# Altium schematic sheet charge_pump.SchDoc
size A; SheetNumber: 6; SheetTotal: 9
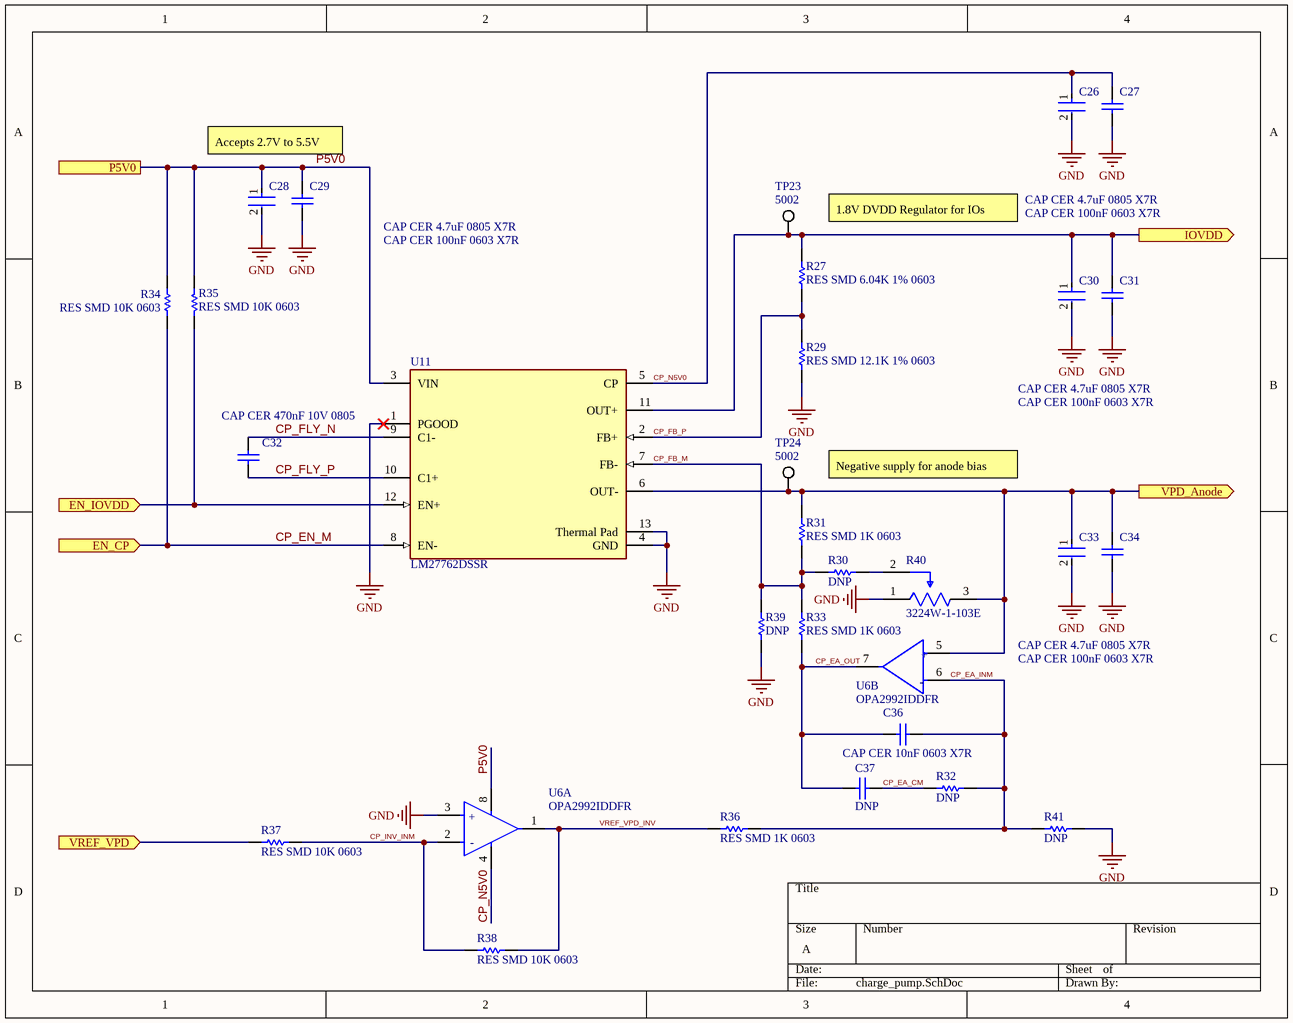
[diagram p0: charge_pump.SchDoc]

## Parts
C26  CAP CER 100nF 0603 X7R  [FP-CC0603-DA-MFG]
C27  CAP CER 4.7uF 0805 X7R  [CAPC2013X140X50NL20T25]
C28  CAP CER 100nF 0603 X7R  [FP-CC0603-DA-MFG]
C29  CAP CER 4.7uF 0805 X7R  [CAPC2013X140X50NL20T25]
C30  CAP CER 100nF 0603 X7R  [FP-CC0603-DA-MFG]
C31  CAP CER 4.7uF 0805 X7R  [CAPC2013X140X50NL20T25]
C32  CAP CER 470nF 10V 0805  [CAPC0805(2012)145_M]
C33  CAP CER 100nF 0603 X7R  [FP-CC0603-DA-MFG]
C34  CAP CER 4.7uF 0805 X7R  [CAPC2013X140X50NL20T25]
C36  CAP CER 10nF 0603 X7R  [CAPC1608X90X40ML10T20]
C37  DNP  [CAPC1608X90X40ML10T20]
R27  RES SMD 6.04K 1% 0603  [RESC1608X55X30LL10T20_A]
R29  RES SMD 12.1K 1% 0603  [RESC1608X55X30LL10T20_A]
R30  DNP  [RESC1608X55X30LL10T20_A]
R31  RES SMD 1K 0603  [RESC1608X55X30LL10T20_A]
R32  DNP  [RESC1609X50X30LL10T20]
R33  RES SMD 1K 0603  [RESC1608X55X30LL10T20_A]
R34  RES SMD 10K 0603  [RESC1609X55X30LL15T15]
R35  RES SMD 10K 0603  [RESC1609X55X30LL15T15]
R36  RES SMD 1K 0603  [RESC1608X55X30LL10T20_A]
R37  RES SMD 10K 0603  [RESC1608X55X30LL10T20_A]
R38  RES SMD 10K 0603  [RESC1608X55X30LL10T20_A]
R39  DNP  [RESC1608X55X30LL10T20_A]
R40  3224W-1-103E  [FP-3224W-MFG]
R41  DNP  [RESC1609X50X30LL10T20]
TP23  5002  [KSTN-5002]
TP24  5002  [KSTN-5002]
U6  OPA2992IDDFR  [FP-DDF0008A-MFG]  (parts A,B of 2)
U11  LM27762DSSR  [FP-DSS0012B-MFG]

## Ports
EN_CP (in), EN_IOVDD (in), IOVDD (out), P5V0, VPD_Anode (out), VREF_VPD (in)

## Nets
GND: C26.2 C27.2 C28.2 C29.2 C30.2 C31.2 C33.2 C34.2 R29.1 R39.1 R40.1(CCW) R41.1 U6.3(IN1+) U11.1(PGOOD) U11.4(GND) U11.13(Thermal_Pad)
CP_EA_CM: C37.2 R32.2
CP_EA_INM: C36.2 R32.1 R36.1 R41.2 U6.6(IN2-)
CP_EA_OUT: C36.1 C37.1 R33.1 U6.7(OUT2)
CP_EN_M: R34.1 U11.8(EN-) ; port EN_CP
CP_FB_M: R30.2 R31.1 R33.2 R39.2 U11.7(FB-)
CP_FB_P: R27.1 R29.2 U11.2(FB+)
CP_FLY_N: C32.2 U11.9(C1-)
CP_FLY_P: C32.1 U11.10(C1+)
CP_INV_INM: R37.1 R38.2 U6.2(IN1-)
CP_N5V0: C26.1 C27.1 U6.4(V-) U11.5(CP)
EN_IOVDD: R35.1 U11.12(EN+) ; port EN_IOVDD
IOVDD: C30.1 C31.1 R27.2 TP23.1 U11.11(OUT+) ; port IOVDD
P5V0: C28.1 C29.1 R34.2 R35.2 U6.8(V+) U11.3(VIN) ; port P5V0
VPD_Anode: C33.1 C34.1 R31.2 R40.3(CW) TP24.1 U6.5(IN2+) U11.6(OUT-) ; port VPD_Anode
VREF_VPD: R37.2 ; port VREF_VPD
VREF_VPD_INV: R36.2 R38.1 U6.1(OUT1)
NetR30_1: R30.1 R40.2(WIPER)

## Notes on the sheet
- Accepts 2.7V to 5.5V
- 1.8V DVDD Regulator for IOs
- Negative supply for anode bias
- (in symbol CMP-04895-000462-1, part A) +; -
- (in symbol CMP-04895-000462-1, part B) +; -

## Library data of the parts
C26 C28 C30 C33 = CMP-03422-000030-1: CAP CER 0.1UF 16V X7R 0603; Manufacturer Part Number: CC0603KRX7R7BB104; Manufacturer: YAGEO; Tolerance: 0.1; Temperature Coefficient: 15%; Material: Ceramic; Voltage Rating: 16 V; Package: CC0603-DA; ComponentLink2Description: Datasheet; Octopart: https://octopart.com/cc0603krx7r7bb104-yageo-192941; Temperature Range High: +125°C; Digikey Description: CAP CER 0.1UF 16V X7R 0603; Value: 100 nF; Voltage: 16 V; Device Class L2: Capacitors; Height: 0.9mm; Temperature: -55°C to +125°C; Device Class L1: Passive Components; Device Class L3: Ceramic Capacitors; ComponentLink2URL: http://www.yageo.com/documents/recent/UPY-GPHC_X7R_6.3V-to-50V_18.pdf; Footprint Url: http://www.yageo.com/exep/pages/download/literatures/UPY-C_GEN_24.pdf; RoHS: TRUE; Temperature Range Low: -55°C; Temperature Characteristic: X7R; Lead Free: Yes; Capacitance: 100 nF; Category: Cap; Mouser Description: Multilayer Ceramic Capacitor, CC Series, 0.1 - F, - 10%, X7R, 16 V, 0603 [1608 Metric]; Automotive: No
C27 C29 C31 C34 = CMP-2007-04677-1: Part Number: 0805ZC475KAT2A; Manufacturer: AVX Interconnect / Elco
C32 = CMP-1036-04629-1: CAP 470nF 10V ±5% 0805 (2012 Metric) Thickness 1.45mm SMD; Case-EIA: 0805; Case-Metric: 2012; Tolerance: Â±5%; Max Thickness: 1.45 mm; Rated Voltage: 10 V; Technology: SMT; Value: 470nF
C36 = CMP-2100-03600-1: Chip Capacitor, 10 nF, +/- 10%, 50 V, -55 to 125 degC, 0603 (1608 Metric), RoHS, Tape and Reel; Manufacturer: Yageo; Insulation Resistance: 100GR; Voltage Rating (DC): 50V; Material: Ceramic; Lead Free: LeadFree; Case/Package: 0603; Datasheet Version: Rev. 15, 10/2016; Composition: Ceramic; Radiation Hardening: No; Thickness: 0.035inch; RoHSCompliant: True; Dielectric: X7R; Termination: SMD/SMT; Capacitance: 10nF; Manufacturer URL: http://www.yageo.com/; Tolerance: 10%; REACH SVHC: NoSVHC; Voltage: 50V; Max Operating Temperature: 125degC; Case Code (Metric): 1608; Package Quantity: 1; Case Code (Imperial): 0603; Packaging: TapeandReel; Package Reference: 0603; Width: 0.031inch; Datasheet URL: http://www.yageo.com/documents/recent/UPY-GPHC_X7R_6.3V-to-50V_15.pdf; Length: 1.6mm; Min Operating Temperature: -55degC; Number of Pins: 2; Depth: 0.8mm; Mount: SurfaceMount; Height: 0.8mm; Voltage Rating: 50V; Package Description: 2-Pin Surface Mount Device, Body 1.6 x 0.8 mm
C37 = CMP-2100-03600-1: Chip Capacitor, 10 nF, +/- 10%, 50 V, -55 to 125 degC, 0603 (1608 Metric), RoHS, Tape and Reel; Manufacturer: Yageo; Insulation Resistance: 100GR; Dielectric: X7R; Voltage Rating (DC): 50V; Capacitance: 10nF; Material: Ceramic; Lead Free: LeadFree; Case/Package: 0603; Datasheet Version: Rev. 15, 10/2016; Composition: Ceramic; Radiation Hardening: No; Thickness: 0.035inch; RoHSCompliant: True; Termination: SMD/SMT; Manufacturer URL: http://www.yageo.com/; Tolerance: 10%; REACH SVHC: NoSVHC; Voltage: 50V; Max Operating Temperature: 125degC; Case Code (Metric): 1608; Package Quantity: 1; Case Code (Imperial): 0603; Packaging: TapeandReel; Package Reference: 0603; Width: 0.031inch; Datasheet URL: http://www.yageo.com/documents/recent/UPY-GPHC_X7R_6.3V-to-50V_15.pdf; Length: 1.6mm; Min Operating Temperature: -55degC; Number of Pins: 2; Depth: 0.8mm; Mount: SurfaceMount; Height: 0.8mm; Voltage Rating: 50V; Package Description: 2-Pin Surface Mount Device, Body 1.6 x 0.8 mm
R27 R29-R31 R33 R36-R39 = CMP-2000-06686-1: Chip Resistor, 0 Ohm, +/- 5%, 100 mW, -55 to 155 degC, 0603 (1608 Metric), RoHS, Tape and Reel; Manufacturer: Rohm; Tolerance: Jumper; Power (Watts): 0.1W,1/10W; Resistance (Ohms): 0.0; Online Catalog: MCR03Series; EDA / CAD Models: DownloadfromAcceleratedDesigns; Other Names: RHM0.0CGTR; Series: MCR; Package Description: 2-Pin Surface Mount Device, Body 1.60 x 0.80 mm; Composition: ThickFilm; Height: 0.022"(0.55mm); Mounting Technology: SurfaceMount; Family: ChipResistor-SurfaceMount; Temperature Coefficient: -; Category: Resistors; Supplier Device Package: 0603(1608Metric); Package Reference: 0603; Size / Dimension: 0.063"Lx0.031"W(1.60mmx0.80mm); Standard Package: 5,000; Datasheet URL: http://www.rohm.com/web/global/datasheet/MCR03ERTJ; Features: -; Datasheet Version: Rev. F, 02/2015; Operating Temperature: -55°C~155°C; Package / Case: 0603(1608Metric); Manufacturer URL: http://www.rohm.com/web/global/; Packaging: Tape&Reel(TR); Number of Terminations: 2
R32 R41 = CMP-2000-03820-1: Part Number: CRCW0603100KFKEA; Manufacturer: Vishay Dale
R34 R35 = CMP-2000-07452-1: Chip Resistor, 10 KOhm, +/- 1%, 0.1 W, -55 to 155 degC, 0603 (1608 Metric), RoHS, Tape and Reel; Manufacturer: Panasonic; Voltage Rating: 75V; Case\/Package: 0603; Power Rating: 100mW; Resistance: 10KOhm; Temperature Coefficient: 100ppm\/degreesC; Number of Pins: 2; Package Reference: 603; Depth: 0.8mm; Mount: SurfaceMount; Package Description: 2-Pin Surface Mount Device, Body 1.6 x 0.85 mm; Datasheet Version: 02/2017; Length: 1.6mm; Lead Free: LeadFree; Height: 0.45mm; Number of Terminations: 2; Max Power Dissipation: 100mW; Min Operating Temperature: -55degC; Datasheet URL: https://industrial.panasonic.com/cdbs/www-data/pdf/RDA0000/AOA0000C304.pdf; Termination: SMD/SMT; Case Code (Metric): 1608; Case Code (Imperial): 0603; Tolerance: 1%; Max Operating Temperature: 155degC; RoHSCompliant: true; Voltage Rating (DC): 75V; Radiation Hardening: No; Packaging: TapeandReel; Composition: ThickFilm; Mounting Technology: SurfaceMount; Manufacturer URL: http://www.panasonic.com/; Width: 0.031inch; REACH SVHC: NoSVHC; Contact Plating: Tin; Military Standard: Not; Package Quantity: 1
R40 = CMP-07234-000002-1: TRIMMER 10K OHM 0.25W J LEAD TOP; Manufacturer: Bourns; Tolerance: 10%; Resistance: 10kΩ; Temperature Coefficient: 100ppm/°C; Value: 10kΩ; Standoff Height: 0.2mm; Voltage Rating: 300V; Power Rating: 250mW; Device Class L3: Variable Resistors and Potentiometers; Composition: Cermet; Temperature Range Low: -65°C; Package: 3224W; ComponentLink2Description: Datasheet; Digikey Description: TRIMMER 10K OHM 0.25W J LEAD TOP; Category: Res; Mouser Description: Trimmer Resistors - SMD 4mm 10Kohms 10% Square Cermet Sealed; Temperature: -65°C to +150°C; Device Class L2: Resistors; Device Class L1: Passive Components; RoHS: TRUE; Temperature Range High: +150°C; Manufacturer Part Number: 3224W-1-103E; ComponentLink2URL: https://upverter.com/datasheet/a166fca85da25564670351d2dc712345c058bc40.pdf; Series: 3224; Height: 5.55mm; Lead Free: Yes; Octopart: https://octopart.com/3224w-1-103e-bourns-14818; Automotive: No
TP23 TP24 = CMP-2000-05182-1: Test Point, White, 1-Pin THD, RoHS, Bulk; Manufacturer: KeystoneElectronics; Outside Diameter: 2.54mm; Plating: Silver; Mounting Hole Size: 1mm; Product: TestPoints; Packaging: Bulk; Manufacturer URL: http://www.keyelco.com/; Length: 7.62mm; Datasheet Version: Rev. G, 12/2008; Type: Miniature; Product Category: CircuitBoardHardware-PCB; Material: Nylon; RoHS: True; Contact Material: PhosphorBronze; Datasheet URL: https://ciiva.com/datasheet-click-2917627?src=ciiva&sig=bd195616; Color: White; Brand: KeystoneElectronics
U6 = CMP-04895-000462-1: IC OPAMP GP 2 CIRCUIT TSOT23-8
U11 = CMP-04918-000139-1: IC REG CHARGE PUMP ADJ DL 12WSON; Switching Frequency: 2.3MHz; Output Current: 250mA; Output Type: Adjustable; Min Output Voltage: 1.5V; Min Input Voltage: 2.7V; Synchronous Rectifier: No; Quiescent Current: 390uA; Max Input Voltage: 5.5V; Max Output Voltage: 5V; Mount: Surface Mount; Lead Free: Lead Free; Topology: Charge Pump; Max Operating Temperature: 85°C; Min Operating Temperature: -40°C; Packaging: Tape and Reel